# EAGLE schematic Sensorschakeling_Linetracker_schema_v1.0 (EAGLE 9.7.0)
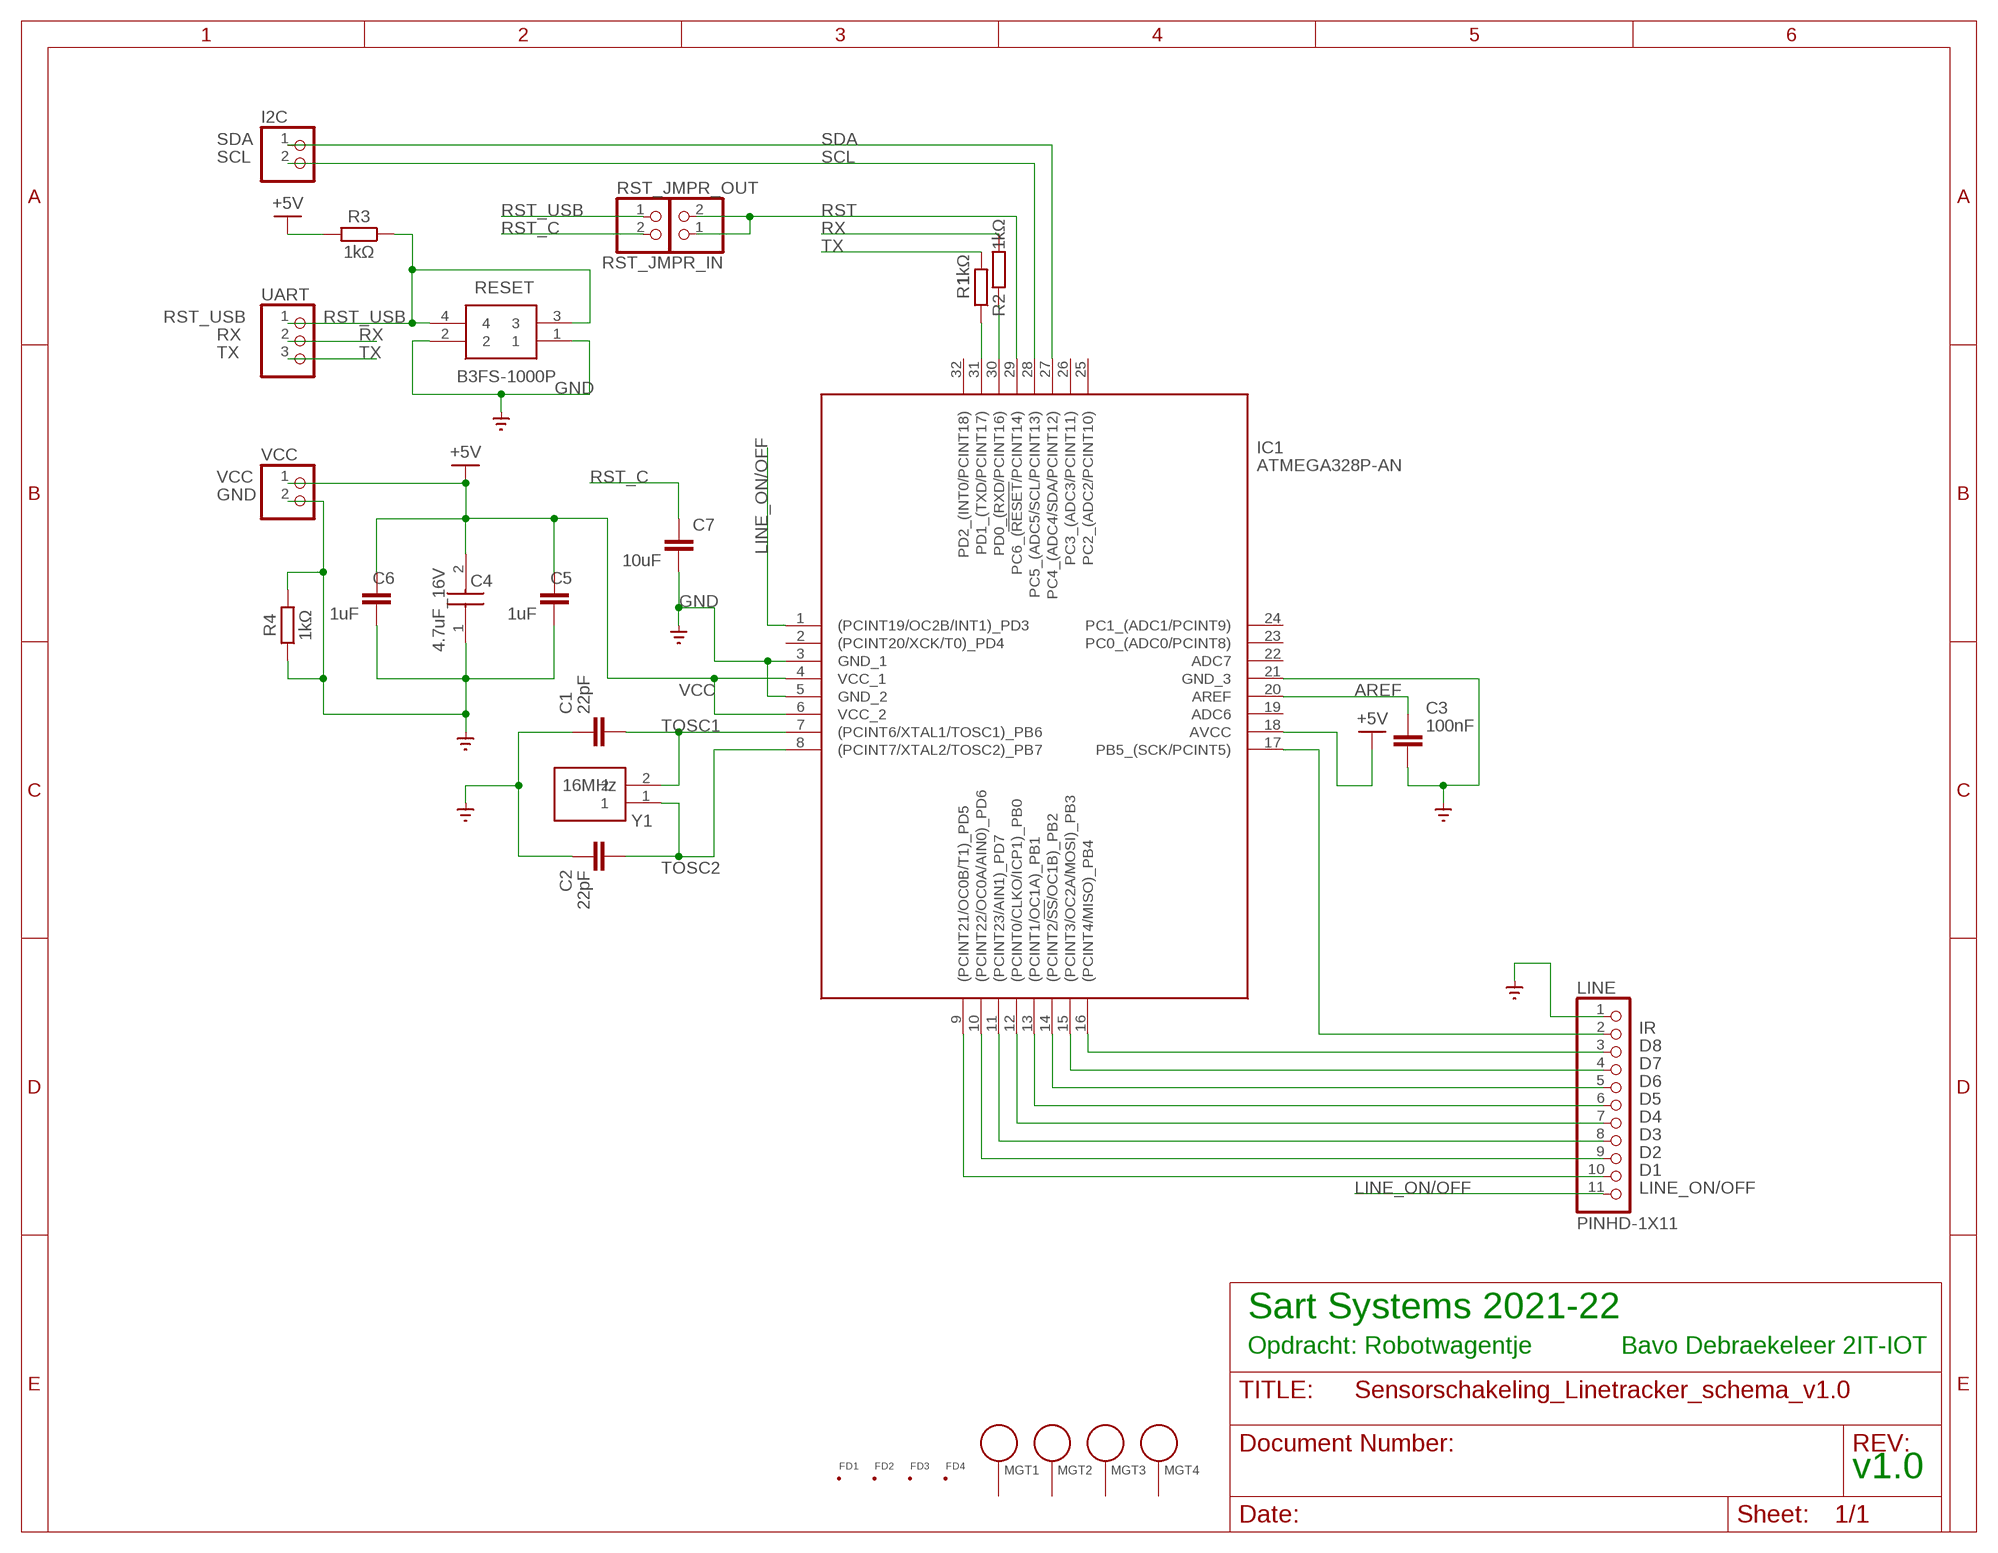
[diagram p0: schematic, sheet 1]

## Parts
C1  22pF  C_CHIP-0805(2012-METRIC)  [CAPC2012X110]
C2  22pF  C_CHIP-0805(2012-METRIC)  [CAPC2012X110]
C3  100nF  C_CHIP-0805(2012-METRIC)  [CAPC2012X110]
C4  4.7uF_16V  CC0805ZKY5V7BB475  [CAPC2012X145N]
C5  1uF  C_CHIP-0805(2012-METRIC)  [CAPC2012X110]
C6  1uF  C_CHIP-0805(2012-METRIC)  [CAPC2012X110]
C7  10uF  C_CHIP-0805(2012-METRIC)  [CAPC2012X110]
FD1  FID_60MIL_P  [FID_060_P]
FD2  FID_60MIL_P  [FID_060_P]
FD3  FID_60MIL_P  [FID_060_P]
FD4  FID_60MIL_P  [FID_060_P]
I2C  PINHD-1X2  [1X02]
IC1  ATMEGA328P-AN  [QFP80P900X900X120-32N]
LINE  PINHD-1X11  [1X11]
MGT1  BEAGLEBONEBLACK_MOUNTING_HOLE  [BEAGLEBONEBLACK_MOUNTING_HOLE]
MGT2  BEAGLEBONEBLACK_MOUNTING_HOLE  [BEAGLEBONEBLACK_MOUNTING_HOLE]
MGT3  BEAGLEBONEBLACK_MOUNTING_HOLE  [BEAGLEBONEBLACK_MOUNTING_HOLE]
MGT4  BEAGLEBONEBLACK_MOUNTING_HOLE  [BEAGLEBONEBLACK_MOUNTING_HOLE]
R1  1kΩ  R_CHIP-0805(2012-METRIC)  [RESC2012X65]
R2  1kΩ  R_CHIP-0805(2012-METRIC)  [RESC2012X65]
R3  1kΩ  R_CHIP-0805(2012-METRIC)  [RESC2012X65]
R4  1kΩ  R_CHIP-0805(2012-METRIC)  [RESC2012X65]
RESET  B3FS-1000P  [B3FS-1000P]
RST_JMPR_IN  PINHD-1X2  [1X02]
RST_JMPR_OUT  PINHD-1X2  [1X02]
UART  PINHD-1X3  [1X03]
VCC  PINHD-1X2  [1X02]
Y1  16MHz  HC49SM-8-30-50-60-16-ATF  [HC49SM830506016ATF]

## Nets
AREF: C3.1 IC1.20(AREF)
D1: IC1.9((PCINT21/OC0B/T1)_PD5) LINE.10
D2: IC1.10((PCINT22/OC0A/AIN0)_PD6) LINE.9
D3: IC1.11((PCINT23/AIN1)_PD7) LINE.8
D4: IC1.12((PCINT0/CLKO/ICP1)_PB0) LINE.7
D5: IC1.13((PCINT1/OC1A)_PB1) LINE.6
D6: IC1.14((PCINT2/!SS!/OC1B)_PB2) LINE.5
D7: IC1.15((PCINT3/OC2A/MOSI)_PB3) LINE.4
D8: IC1.16((PCINT4/MISO)_PB4) LINE.3
GND: C1.1 C2.1 C3.2 C4.1 C5.1 C6.1 C7.1 IC1.3(GND_1) IC1.5(GND_2) IC1.21(GND_3) LINE.1 R4.1 R4.2 RESET.1 RESET.2 VCC.2 ; supply symbol labelled SUPPLY0_GND_
IR: IC1.17(PB5_(SCK/PCINT5)) LINE.2
LINE_ON/OFF: IC1.1((PCINT19/OC2B/INT1)_PD3) LINE.11
N$1: IC1.31(PD1_(TXD/PCINT17)) R1.1
N$2: IC1.30(PD0_(RXD/PCINT16)) R2.1
RST: IC1.29(PC6_(!RESET!/PCINT14)) RST_JMPR_IN.1 RST_JMPR_IN.2
RST_C: C7.2 RST_JMPR_OUT.2
RST_USB: R3.1 RESET.3 RESET.4 RST_JMPR_OUT.1 UART.1
RX: R2.2 UART.2
SCL: I2C.2 IC1.28(PC5_(ADC5/SCL/PCINT13))
SDA: I2C.1 IC1.27(PC4_(ADC4/SDA/PCINT12))
TOSC1: C1.2 IC1.7((PCINT6/XTAL1/TOSC1)_PB6) Y1.2
TOSC2: C2.2 IC1.8((PCINT7/XTAL2/TOSC2)_PB7) Y1.1
TX: R1.2 UART.3
VCC: C4.2 C5.2 C6.2 IC1.4(VCC_1) IC1.6(VCC_2) IC1.18(AVCC) R3.2 VCC.1 ; supply symbol labelled +5V
Unconnected: IC1.2((PCINT20/XCK/T0)_PD4) IC1.19(ADC6) IC1.22(ADC7) IC1.23(PC0_(ADC0/PCINT8)) IC1.24(PC1_(ADC1/PCINT9)) IC1.25(PC2_(ADC2/PCINT10)) IC1.26(PC3_(ADC3/PCINT11)) IC1.32(PD2_(INT0/PCINT18)) MGT1.P$1 MGT2.P$1 MGT3.P$1 MGT4.P$1

## Notes on the sheet
- Sart Systems 2021-22
- Opdracht: Robotwagentje | Bavo Debraekeleer 2IT-IOT
- v1.0

## Library data of the parts
C1-C3 C5-C7 = Capacitor:C: Capacitor - Generic; CATEGORY: Capacitor
C4 = CC0805ZKY5V7BB475:CC0805ZKY5V7BB475: YAGEO - CC0805ZKY5V7BB475 - SMD Multilayer Ceramic Capacitor, 4.7 F, 16 V, 0805 [2012 Metric], +80%, -20%, Y5V, CC Series Source: Datasheet <https://4donline.ihs.com/images/VipMasterIC/IC/YAGO/YAGO-S-A0004841839/YAGO-S-A0004841839-1.pdf?hkey=6D3A4C79FDBF58556ACFDE234799DDF0>; ARROW_PART_NUMBER: CC0805ZKY5V7BB475; ARROW_PRICE-STOCK: https://www.arrow.com/en/products/cc0805zky5v7bb475/yageo; DESCRIPTION: YAGEO - CC0805ZKY5V7BB475 - SMD Multilayer Ceramic Capacitor, 4.7 F, 16 V, 0805 [2012 Metric], +80%, -20%, Y5V, CC Series; HEIGHT: 1.45mm; MANUFACTURER_NAME: KEMET; MANUFACTURER_PART_NUMBER: CC0805ZKY5V7BB475; MOUSER_PART_NUMBER: 603-CC805ZKY5V7BB475; MOUSER_PRICE-STOCK: https://www.mouser.co.uk/ProductDetail/Yageo/CC0805ZKY5V7BB475?qs=7s%252B3O6pAiyA4wtTM471wUA%3D%3D
FD1-FD4 = Fiducial:FID: Fiducial marks. Top and Bottom copper with stop mask
I2C RST_JMPR_IN RST_JMPR_OUT VCC = pinhead:PINHD-1X2: PIN HEADER
IC1 = ATMEGA328P-AN:ATMEGA328P-AN: MCU 8-bit ATmega AVR RISC 32KB Flash Atmel ATMEGA328P-AN, 8bit AVR Microcontroller, 20MHz, 32 kB Flash, 32-Pin TQFP Source: Datasheet <https://datasheet.datasheetarchive.com/originals/distributors/Datasheets_SAMA/81e6b951babeaaddc9de6b0e081ba8bf.pdf>; ARROW_PART_NUMBER: ATMEGA328P-AN; ARROW_PRICE-STOCK: https://www.arrow.com/en/products/atmega328p-an/microchip-technology?region=nac; DESCRIPTION: MCU 8-bit ATmega AVR RISC 32KB Flash Atmel ATMEGA328P-AN, 8bit AVR Microcontroller, 20MHz, 32 kB Flash, 32-Pin TQFP; HEIGHT: 1.2mm; MANUFACTURER_NAME: Microchip; MANUFACTURER_PART_NUMBER: ATMEGA328P-AN; MOUSER_PART_NUMBER: 556-ATMEGA328P-AN; MOUSER_PRICE-STOCK: https://www.mouser.co.uk/ProductDetail/Microchip-Technology-Atmel/ATMEGA328P-AN?qs=6Dg1WZIWLC6WK556tw8xAw%3D%3D
LINE = Connector:PINHD-1X11: PIN HEADER; CATEGORY: CONNECTOR; SUB-CATEGORY: PIN-HEADER
MGT1-MGT4 = BeagleBone_Black_Wireless:BEAGLEBONEBLACK_MOUNTING_HOLE: Chassis Mounting Hole w/GND connection ability
R1-R4 = Resistor:R: Resistor Fixed - Generic; CATEGORY: Resistor; SUB-CATEGORY: Fixed
RESET = B3FS-1000P:B3FS-1000P: Switch Tact,6x6mm,flat act,gen purp,tape Plunger Tactile Switch, SPST-NO 0.05 A@ 24 V dc 0.5mm Source: Datasheet <https://www.omron.co.jp/ecb/products/pdf/b3fs.pdf>; ARROW_PART_NUMBER: B3FS-1000P; ARROW_PRICE-STOCK: https://www.arrow.com/en/products/b3fs-1000p/omron?region=nac; DESCRIPTION: Switch Tact,6x6mm,flat act,gen purp,tape Plunger Tactile Switch, SPST-NO 0.05 A@ 24 V dc 0.5mm; HEIGHT: mm; MANUFACTURER_NAME: Omron Electronics; MANUFACTURER_PART_NUMBER: B3FS-1000P; MOUSER_PART_NUMBER: 653-B3FS-1000P; MOUSER_PRICE-STOCK: https://www.mouser.co.uk/ProductDetail/Omron-Electronics/B3FS-1000P?qs=ImaqFqjHA4k6odVF2%2FXWpQ%3D%3D
UART = pinhead:PINHD-1X3: PIN HEADER
Y1 = HC49SM-8-30-50-60-16-ATF:HC49SM-8-30-50-60-16-ATF: MULTICOMP - HC49SM-8-30-50-60-16-ATF - CRYSTAL, 8MHZ, 16PF, SMD Source: Datasheet <http://www.farnell.com/datasheets/1661828.pdf>; DESCRIPTION: MULTICOMP - HC49SM-8-30-50-60-16-ATF - CRYSTAL, 8MHZ, 16PF, SMD; HEIGHT: 4mm; MANUFACTURER_NAME: MULTICOMP; MANUFACTURER_PART_NUMBER: HC49SM-8-30-50-60-16-ATF